# Altium project FlightControl.PrjPcb
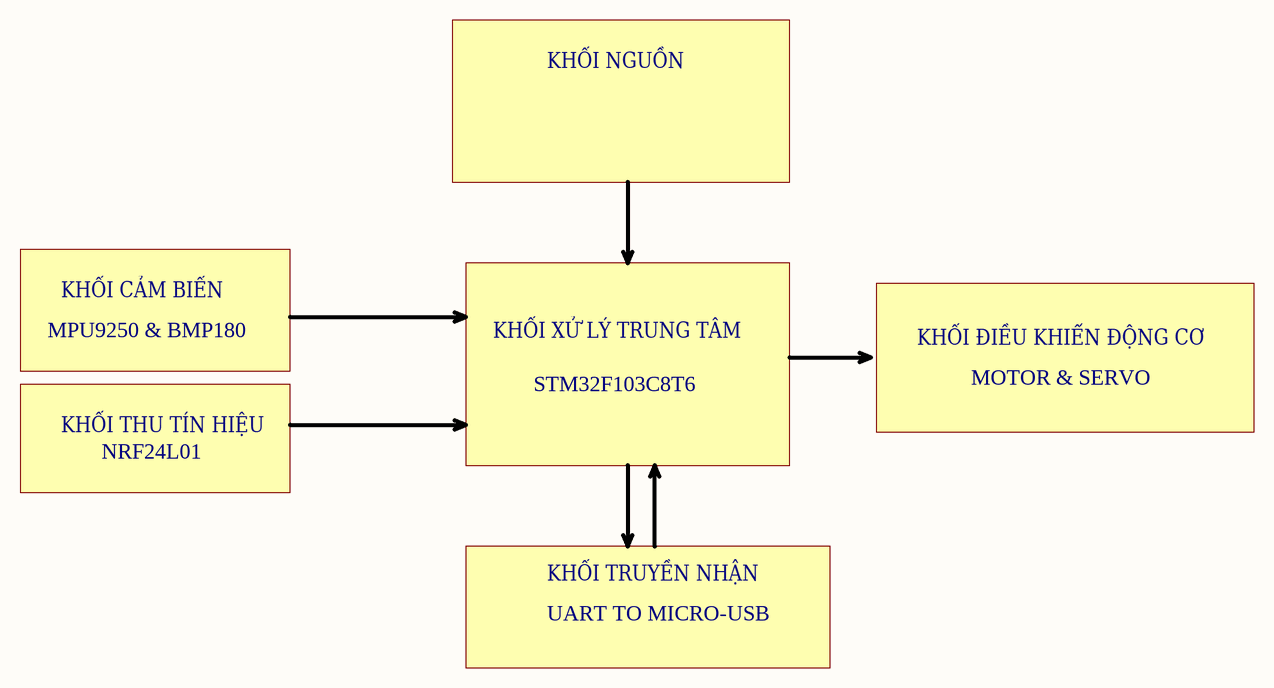
[diagram p0: Block_Diagram.SchDoc]
7 sheets, 90 parts. Net scope: flat (ports and power ports of the same name join across sheets).
Board files: PCB1.PcbDoc, PCB4.PcbDoc
Sheets:
  Block_Diagram.SchDoc
  power_Diagram.SchDoc
  MCU.SchDoc
  Motor_Servo.SchDoc
  Power_Supply.SchDoc
  UART_to_Micro_USB.SchDoc
  Sensor_Input.SchDoc

## Sheet Block_Diagram.SchDoc
size A4; Organization: Altium Limited; Address1: L3, 12a Rodborough Rd; Address2: Frenchs Forest; Address3: NSW; Address4: Australia 2086

### Notes on the sheet
- KHỐI NGUỒN
- KHỐI CẢM BIẾN
- MPU9250 & BMP180
- KHỐI XỬ LÝ TRUNG TÂM
- KHỐI ĐIỀU KHIỂN ĐỘNG CƠ
- MOTOR & SERVO
- KHỐI THU TÍN HIỆU
- STM32F103C8T6
- NRF24L01
- KHỐI TRUYỀN NHẬN
- UART TO MICRO-USB
- Title
- Size:
- Date:
- A4
- Number:
- Time:
- Revision:
- Sheet
- of
- File:

## Sheet power_Diagram.SchDoc
size A4; Organization: Altium Limited; Address1: L3, 12a Rodborough Rd; Address2: Frenchs Forest; Address3: NSW; Address4: Australia 2086
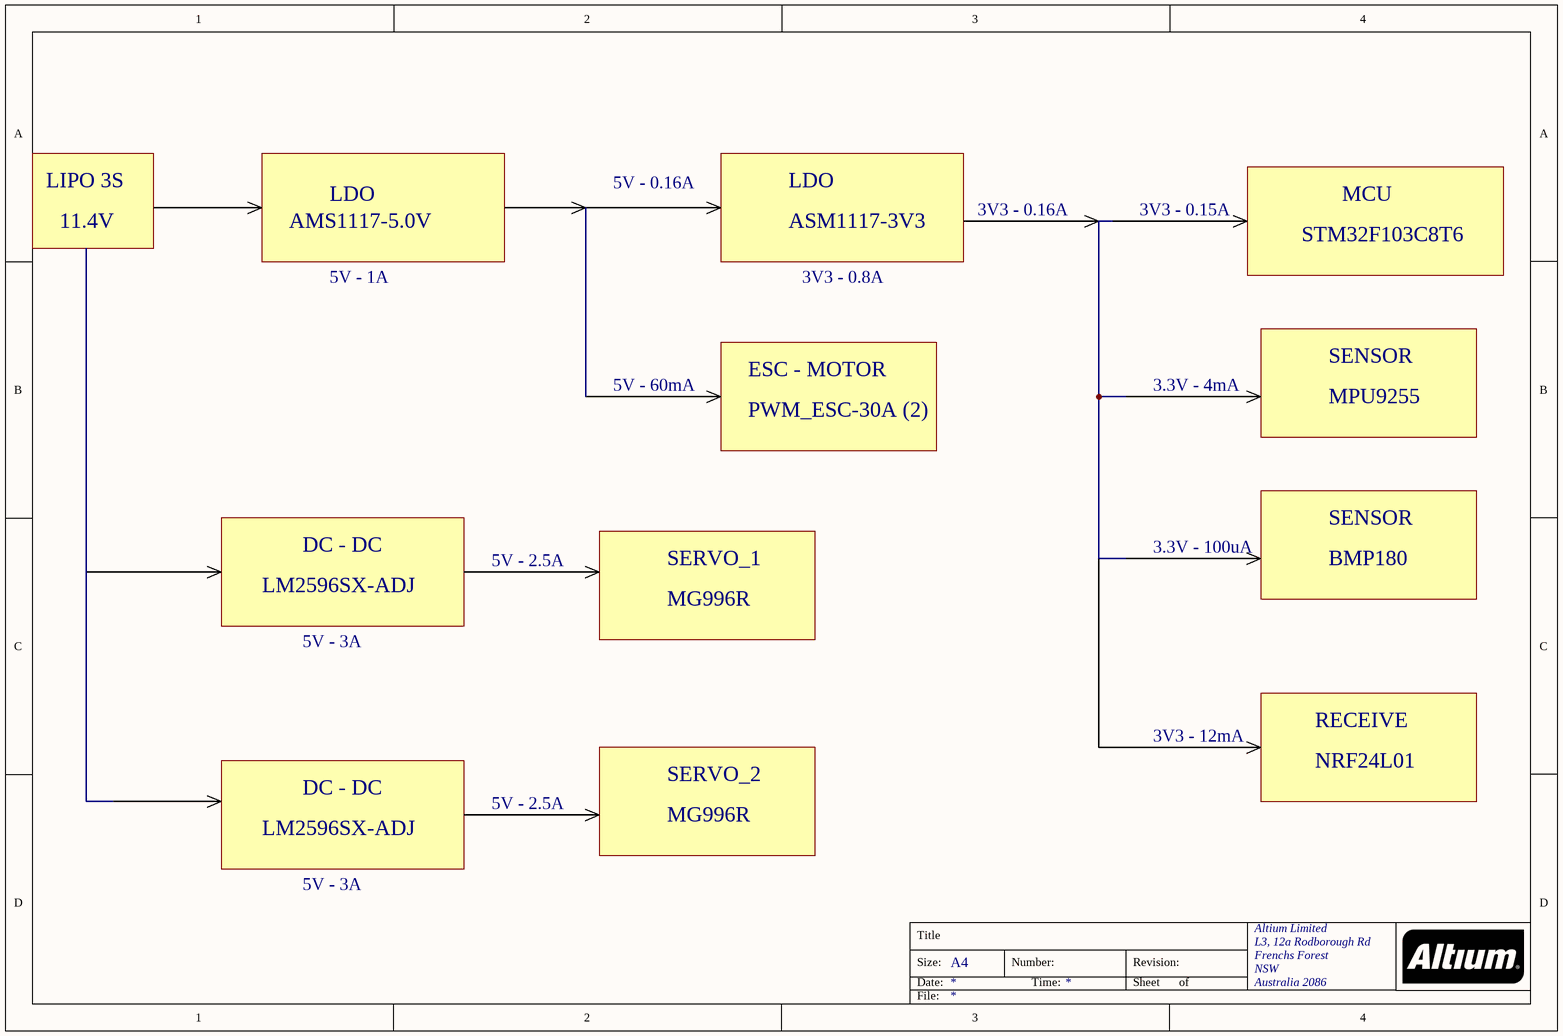
[diagram p1: power_Diagram.SchDoc]

### Notes on the sheet
- LIPO 3S
- 11.4V
- AMS1117-5.0V
- LDO
- 5V - 0.16A
- ASM1117-3V3
- 3V3 - 0.16A
- 3V3 - 0.15A
- STM32F103C8T6
- MCU
- 5V - 1A
- 3V3 - 0.8A
- ESC - MOTOR
- SENSOR
- 5V - 60mA
- PWM_ESC-30A (2)
- 3.3V - 4mA
- MPU9255
- DC - DC
- 5V - 2.5A
- SERVO_1
- 3.3V - 100uA
- BMP180
- LM2596SX-ADJ
- 5V - 3A
- MG996R
- SERVO_2
- 3V3 - 12mA
- RECEIVE
- NRF24L01
- Title
- Size:
- Date:
- A4
- Number:
- Time:
- Revision:
- Sheet
- of
- File:

## Sheet MCU.SchDoc
size A4; Organization: Altium Limited; Address1: L3, 12a Rodborough Rd; Address2: Frenchs Forest; Address3: NSW; Address4: Australia 2086
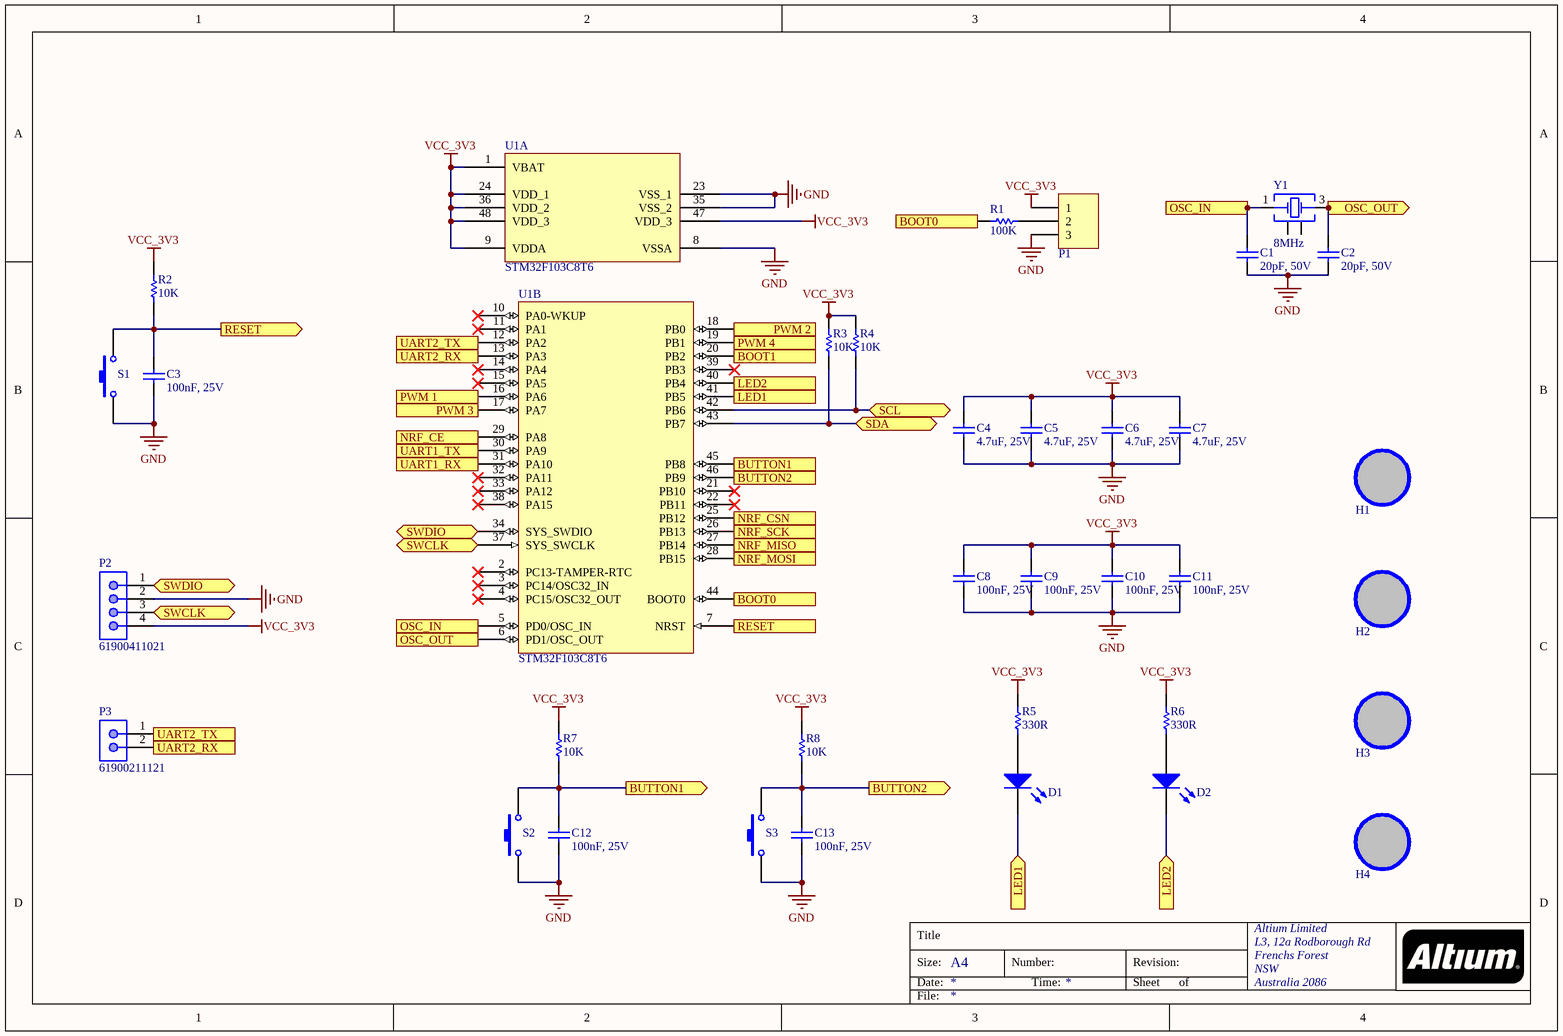
[diagram p2: MCU.SchDoc]

### Parts
C1  value 20pF, 50V  [CAP-SM-0805]  (hidden comment: Cap Non-Pol SMD)
C2  value 20pF, 50V  [CAP-SM-0805]  (hidden comment: Cap Non-Pol SMD)
C3  value 100nF, 25V  [CAP-SM-0805]  (hidden comment: Cap Non-Pol SMD)
C4  value 4.7uF, 25V  [CAP-SM-0805]  (hidden comment: Cap Non-Pol SMD)
C5  value 4.7uF, 25V  [CAP-SM-0805]  (hidden comment: Cap Non-Pol SMD)
C6  value 4.7uF, 25V  [CAP-SM-0805]  (hidden comment: Cap Non-Pol SMD)
C7  value 4.7uF, 25V  [CAP-SM-0805]  (hidden comment: Cap Non-Pol SMD)
C8  value 100nF, 25V  [CAP-SM-0805]  (hidden comment: Cap Non-Pol SMD)
C9  value 100nF, 25V  [CAP-SM-0805]  (hidden comment: Cap Non-Pol SMD)
C10  value 100nF, 25V  [CAP-SM-0805]  (hidden comment: Cap Non-Pol SMD)
C11  value 100nF, 25V  [CAP-SM-0805]  (hidden comment: Cap Non-Pol SMD)
C12  value 100nF, 25V  [CAP-SM-0805]  (hidden comment: Cap Non-Pol SMD)
C13  value 100nF, 25V  [CAP-SM-0805]  (hidden comment: Cap Non-Pol SMD)
D1  LED SMD  [LED_0603_Blue]  (value not drawn)
D2  LED SMD  [LED_0603_Blue]  (value not drawn)
H1  Hole  [LO KHOAN 3MM]  (value not drawn)
H2  Hole  [LO KHOAN 3MM]  (value not drawn)
H3  Hole  [LO KHOAN 3MM]  (value not drawn)
H4  Hole  [LO KHOAN 3MM]  (value not drawn)
P1  Header 3  [JP3]  (value not drawn)
P2  61900411021  [61900411021]
P3  61900211121  [61900211121]
R1  value 100K  [RES-SM-0805]  (hidden comment: RESISTOR SMD)
R2  value 10K  [RES-SM-0805]  (hidden comment: RESISTOR SMD)
R3  value 10K  [RES-SM-0805]  (hidden comment: RESISTOR SMD)
R4  value 10K  [RES-SM-0805]  (hidden comment: RESISTOR SMD)
R5  value 330R  [RES-SM-0805]  (hidden comment: RESISTOR SMD)
R6  value 330R  [RES-SM-0805]  (hidden comment: RESISTOR SMD)
R7  value 10K  [RES-SM-0805]  (hidden comment: RESISTOR SMD)
R8  value 10K  [RES-SM-0805]  (hidden comment: RESISTOR SMD)
S1  Tact SW - 2Pin  [SW-SMD]  (value not drawn)
S2  Tact SW - 2Pin  [SW-SMD]  (value not drawn)
S3  Tact SW - 2Pin  [SW-SMD]  (value not drawn)
U1  STM32F103C8T6  [LQFP48]  (parts A,B of 2)
Y1  8MHz  [WE-XTAL_CFPX-104]

### Ports
BOOT0 (in), BOOT0 (out), BOOT1 (in), BUTTON1 (in), BUTTON1 (out), BUTTON2 (in), BUTTON2 (out), LED1 (in), LED1 (out), LED2 (in), LED2 (out), NRF_CE (out), NRF_CSN (out), NRF_MISO (in), NRF_MOSI (out), NRF_SCK (out), OSC_IN (in), OSC_IN (out), OSC_OUT (in), OSC_OUT (out), PWM 1 (out), PWM 2 (out), PWM 3 (out), PWM 4 (out), RESET (in), RESET (out), SCL (bidir), SDA (bidir), SWCLK (bidir), SWDIO (bidir), UART1_RX (in), UART1_TX (out), UART2_RX (in), UART2_RX (out), UART2_TX (in), UART2_TX (out)

### Nets
GND: C1.1 C2.1 C3.1 C4.1 C5.1 C6.1 C7.1 C8.1 C9.1 C10.1 C11.1 C12.1 C13.1 P1.3 P2.2 S1.1 S2.1 S3.1 U1.8(VSSA) U1.23(VSS_1) U1.35(VSS_2)
VCC_3V3: C4.2 C5.2 C6.2 C7.2 C8.2 C9.2 C10.2 C11.2 P1.1 P2.4 R2.1 R3.1 R4.1 R5.2 R6.2 R7.1 R8.1 U1.1(VBAT) U1.9(VDDA) U1.24(VDD_1) U1.36(VDD_2) U1.47(VDD_3) U1.48(VDD_3)
RXD: U1.31(PA10) ; port UART1_RX
TXD: U1.30(PA9) ; port UART1_TX
Net1_3: R4.2 U1.42(PB6) ; port SCL
Net1_4: R3.2 U1.43(PB7) ; port SDA
NetC1_2: C1.2 U1.5(PD0/OSC_IN) Y1.1(OSC1) ; port OSC_IN
NetC2_2: C2.2 U1.6(PD1/OSC_OUT) Y1.3(OSC2) ; port OSC_OUT
NetC3_2: C3.2 R2.2 S1.2 U1.7(NRST) ; port RESET
NetC12_2: C12.2 R7.2 S2.2 U1.45(PB8) ; port BUTTON1
NetC13_2: C13.2 R8.2 S3.2 U1.46(PB9) ; port BUTTON2
NetD1_1: D1.1(A) R5.1
NetD1_2: D1.2(K) U1.41(PB5) ; port LED1
NetD2_1: D2.1(A) R6.1
NetD2_2: D2.2(K) U1.40(PB4) ; port LED2
NetM1_2: U1.29(PA8) ; port NRF_CE
NetM1_3: U1.26(PB13) ; port NRF_SCK
NetM1_4: U1.27(PB14) ; port NRF_MISO
NetM1_6: U1.28(PB15) ; port NRF_MOSI
NetM1_7: U1.25(PB12) ; port NRF_CSN
NetP1_2: P1.2 R1.2
NetP2_1: P2.1 U1.34(SYS_SWDIO) ; port SWDIO
NetP2_3: P2.3 U1.37(SYS_SWCLK) ; port SWCLK
NetP3_1: P3.1 U1.12(PA2) ; port UART2_TX
NetP3_2: P3.2 U1.13(PA3) ; port UART2_RX
NetP6_3: U1.18(PB0) ; port PWM 2
NetP7_3: U1.19(PB1) ; port PWM 4
NetQ1_2: U1.16(PA6) ; port PWM 1
NetQ2_2: U1.17(PA7) ; port PWM 3
NetR1_1: R1.1 U1.44(BOOT0) ; port BOOT0
NetU1_20: U1.20(PB2) ; port BOOT1

Not connected (* = marked no-connect by the designer): H1 1; H2 1; H3 1; H4 1; U1 2(PC13-TAMPER-RTC)* 3(PC14/OSC32_IN)* 4(PC15/OSC32_OUT)* 10(PA0-WKUP)* 11(PA1)* 14(PA4)* 15(PA5)* 21(PB10)* 22(PB11)* 32(PA11)* 33(PA12)* 38(PA15)* 39(PB3)*; Y1 2(GND) 4(GND)

### Notes on the sheet
- Title
- Size:
- Date:
- A4
- Number:
- Time:
- Revision:
- Sheet
- of
- File:

### Library data of the parts
C1-C13 = Cap Non-Pol SMD: Capacitor
D1 D2 = LED SMD: LED
H1-H4 = Hole: Hole 3mm
P1 = Header 3: Header, 3-Pin; LatestRevisionDate: 17-Jul-2002; LatestRevisionNote: Re-released for DXP Platform.; Publisher: Altium Limited
P2 = 61900411021: WR-WTB THT Male Left Angled Bottom Locking Header, pitch 2.54mm, 4p; Pin Number: 4; Contact Resistance: 20mOhm; Rated Current: 3A; Withstanding Voltage: 1000VAC; Working Voltage: 250VAC; ComponentLink1Description: Manufacturer; ComponentLink1URL: http://www.we-online.de; ComponentLink2Description: Datasheet; ComponentLink2URL: https://www.we-online.com/catalog/datasheet/61900411021.pdf; Pitch: 2.54mm; Published Date: January 2020; Publisher: Wurth Elektronik; Mounting Technology: THT; Packaging: Bag; Operating Temperature: -40 to +105degC; Part Number: 61900411021; Gender: Male; Type: Right Angled Bottom Locking
P3 = 61900211121: WR-WTB THT Male Vertical Locking Header, pitch 2.54mm, 2p; Pin Number: 2; Contact Resistance: 20mOhm; Rated Current: 3A; Withstanding Voltage: 1000VAC; Working Voltage: 250VAC; ComponentLink1Description: Manufacturer; ComponentLink1URL: http://www.we-online.de; ComponentLink2Description: Datasheet; ComponentLink2URL: https://www.we-online.com/catalog/datasheet/61900211121.pdf; Pitch: 2.54mm; Published Date: January 2020; Publisher: Wurth Elektronik; Mounting Technology: THT; Packaging: Bag; Operating Temperature: -40 to +105degC; Part Number: 61900211121; Gender: Male; Type: Vertical
R1-R8 = RESISTOR SMD: Resistor
S1-S3 = Tact SW - 2Pin: Switch button 2 pin
U1 = STM32F103C8T6: ARM Microcontrollers - MCU 32BIT Cortex M3 64KB 20KB RAM 2X12 ADC; Manufacturer: STMicroelectronics; Core: ARM Cortex M3; ADC Resolution: 12 bit; Maximum Clock Frequency: 72 MHz; Number of I/Os: 37 I/O; Supply Voltage - Min: 2 V; Supply Voltage - Max: 3.6 V; Interface Type: CAN, I2C, SPI, USART, USB; Data RAM Type: SRAM; Number of ADC Channels: 10 Channel; Number of Timers/Counters: 3 Timer; Processor Series: ARM Cortex M; Product Category: ARM Microcontrollers - MCU; Series: STM32F103C8; Mounting Style: SMD/SMT; Package / Case: LQFP-48; Program Memory Size: 64 kB; Data Bus Width: 32 bit; Data RAM Size: 20 kB; Minimum Operating Temperature: - 40 C; Maximum Operating Temperature: + 85 C; Length: 7 mm; ComponentLink1Description: Datasheet; ComponentLink1URL: https://www.mouser.vn/datasheet/2/389/stm32f103c8-1851025.pdf
Y1 = 830106162701: WE-XTAL Quartz Crystal, SMT, CFPX-104, 8MHz, +/-20ppm; Manufacturer: Wurth Elektronik; Frequency Stability: +/-30ppm; Load Capacitance: 16pF; ComponentLink1Description: Manufacturer; ComponentLink1URL: http://www.we-online.de; ComponentLink2Description: Datasheet; ComponentLink2URL: https://www.we-online.com/catalog/datasheet/830106162701.pdf; Operating Temperature: -40 to +85degC; Packaging: Tape and Reel; Manufacturer Part Number: 830106162701; Published Date: November 2020; Size: CFPX-104; Frequency: 8MHz; Frequency Tolerance: +/-20ppm; Mounting Technology: SMT

## Sheet Motor_Servo.SchDoc
size A4; Organization: Altium Limited; Address1: L3, 12a Rodborough Rd; Address2: Frenchs Forest; Address3: NSW; Address4: Australia 2086
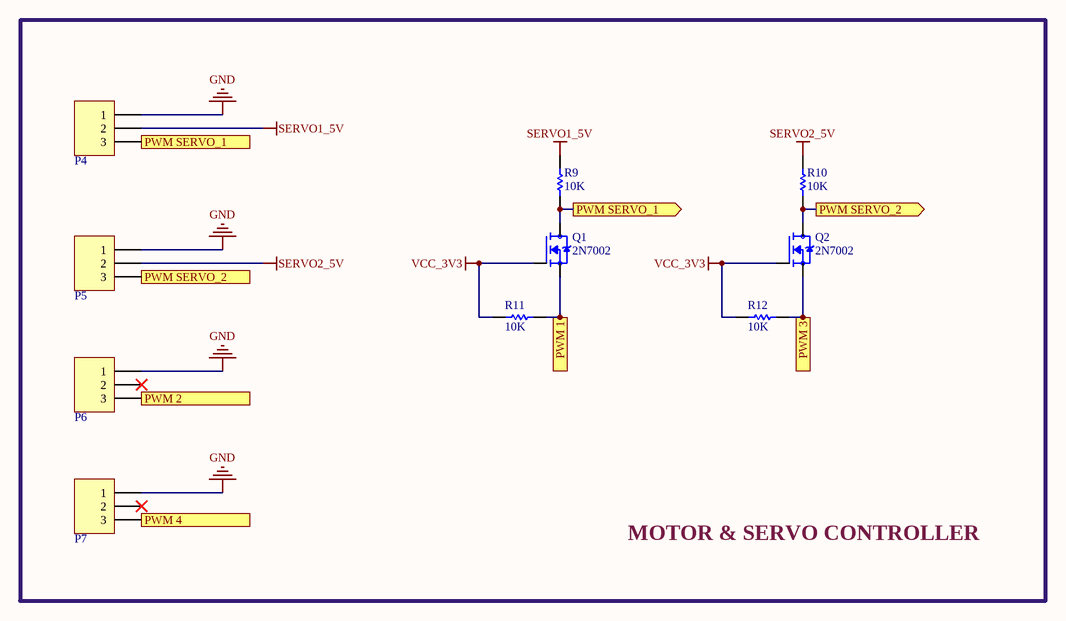
[diagram p3: Motor_Servo.SchDoc]

### Parts
P4  Header 3H  [JP3H]  (value not drawn)
P5  Header 3H  [JP3H]  (value not drawn)
P6  Header 3H  [JP3H]  (value not drawn)
P7  Header 3H  [JP3H]  (value not drawn)
Q1  2N7002  [SOT95P240X111-3N]
Q2  2N7002  [SOT95P240X111-3N]
R9  value 10K  [RES-SM-0805]  (hidden comment: RESISTOR SMD)
R10  value 10K  [RES-SM-0805]  (hidden comment: RESISTOR SMD)
R11  value 10K  [RES-SM-0805]  (hidden comment: RESISTOR SMD)
R12  value 10K  [RES-SM-0805]  (hidden comment: RESISTOR SMD)

### Blocks framed on the sheet
MOTOR & SERVO CONTROLLER: P4-P7 Q1 Q2 R9-R12

### Ports
PWM 1 (in), PWM 2 (out), PWM 3 (in), PWM 4 (out), PWM SERVO_1 (out), PWM SERVO_2 (out)

### Nets
GND: P4.1 P5.1 P6.1 P7.1
SERVO1_5V: P4.2 R9.2
SERVO2_5V: P5.2 R10.2
VCC_3V3: Q1.1(G) Q2.1(G) R11.2 R12.2
NetP4_3: P4.3 Q1.3(D) R9.1 ; port PWM SERVO_1
NetP5_3: P5.3 Q2.3(D) R10.1 ; port PWM SERVO_2
NetP6_3: P6.3 ; port PWM 2
NetP7_3: P7.3 ; port PWM 4
NetQ1_2: Q1.2(S) R11.1 ; port PWM 1
NetQ2_2: Q2.2(S) R12.1 ; port PWM 3

Not connected (* = marked no-connect by the designer): P6 2*; P7 2*

### Notes on the sheet
- Title
- Size:
- Date:
- A4
- Number:
- Time:
- Revision:
- Sheet
- of
- File:

### Library data of the parts
P4-P7 = Header 3H: Header, 3-Pin, Right Angle; LatestRevisionDate: 17-Jul-2002; LatestRevisionNote: Re-released for DXP Platform.; Publisher: Altium Limited
Q1 Q2 = 2N7002: N-Channel 60V 280mA (Ta) 350mW (Ta) Surface Mount SOT-23-3 (TO-236); MP: altium_native_batch; Package: None; Price: None; Availability: Unavailable; Value: *
R9-R12 = RESISTOR SMD: Resistor

## Sheet Power_Supply.SchDoc
size A4; Organization: Altium Limited; Address1: L3, 12a Rodborough Rd; Address2: Frenchs Forest; Address3: NSW; Address4: Australia 2086
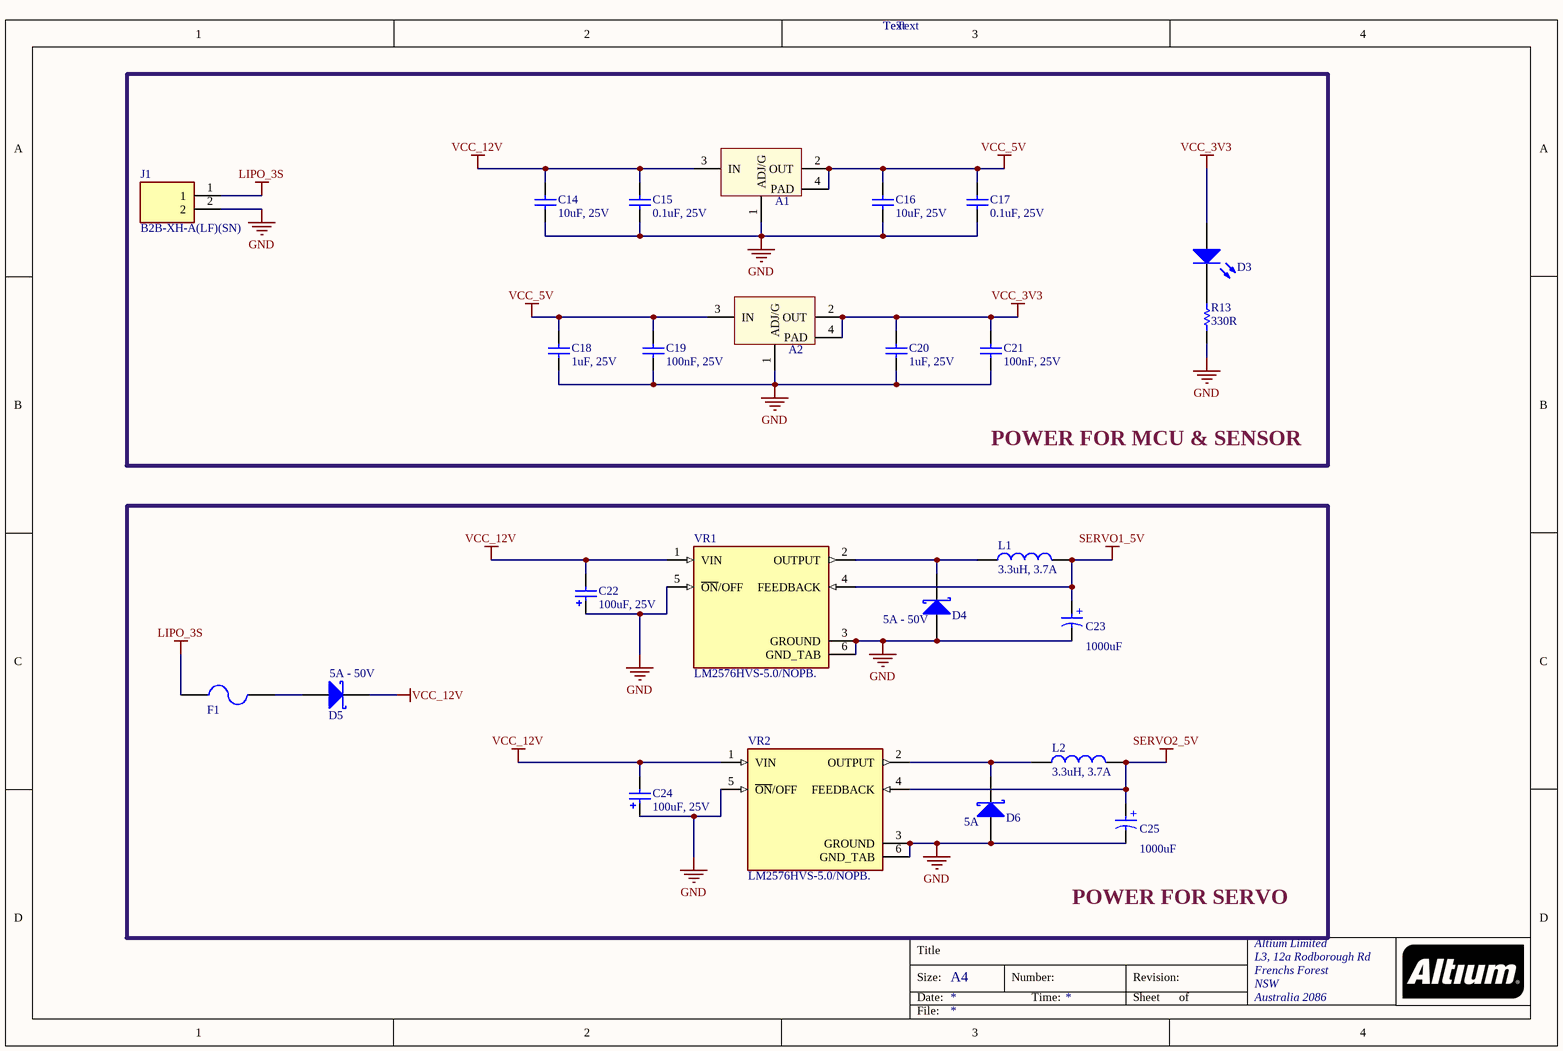
[diagram p4: Power_Supply.SchDoc]

### Parts
A1  LM1117  [SOT223-4N]  (value not drawn)
A2  LM1117  [SOT223-4N]  (value not drawn)
C14  value 10uF, 25V  [CAP-SM-0805]  (hidden comment: Cap Non-Pol SMD)
C15  value 0.1uF, 25V  [CAP-SM-0805]  (hidden comment: Cap Non-Pol SMD)
C16  value 10uF, 25V  [CAP-SM-0805]  (hidden comment: Cap Non-Pol SMD)
C17  value 0.1uF, 25V  [CAP-SM-0805]  (hidden comment: Cap Non-Pol SMD)
C18  value 1uF, 25V  [CAP-SM-0805]  (hidden comment: Cap Non-Pol SMD)
C19  value 100nF, 25V  [CAP-SM-0805]  (hidden comment: Cap Non-Pol SMD)
C20  value 1uF, 25V  [CAP-SM-0805]  (hidden comment: Cap Non-Pol SMD)
C21  value 100nF, 25V  [CAP-SM-0805]  (hidden comment: Cap Non-Pol SMD)
C22  value 100uF, 25V  [CAP ALU SIZE F]  (hidden comment: Cap Pol SMD)
C23  1000uF  [WCAP-ASLI_D12.5H14]  (value not drawn)
C24  value 100uF, 25V  [CAP ALU SIZE F]  (hidden comment: Cap Pol SMD)
C25  1000uF  [WCAP-ASLI_D12.5H14]  (value not drawn)
D3  LED SMD  [LED_0603_Blue]  (value not drawn)
D4  D Schottky  [SS34]  (value not drawn)
D5  D Schottky  [SS34]  (value not drawn)
D6  D Schottky  [SS34]  (value not drawn)
F1  Fuse  [FUSE SMD]  (value not drawn)
J1  B2B-XH-A(LF)(SN)  [JST_B2B-XH-A(LF)(SN)]
L1  3.3uH, 3.7A  [WE-PD2A_5848]
L2  3.3uH, 3.7A  [WE-PD2A_5848]
R13  value 330R  [RES-SM-0805]  (hidden comment: RESISTOR SMD)
VR1  LM2576HVS-5.0/NOPB.  [TO170P1524X483-6N]
VR2  LM2576HVS-5.0/NOPB.  [TO170P1524X483-6N]

### Blocks framed on the sheet
POWER FOR MCU & SENSOR: A1 A2 C14-C21 D3 J1 R13
POWER FOR SERVO: C22-C25 D4-D6 F1 L1 L2 VR1 VR2

### Nets
GND: A1.1(ADJ/G) A2.1(ADJ/G) C14.1 C15.1 C16.1 C17.1 C18.1 C19.1 C20.1 C21.1 C22.1 C23.2(N) C24.1 C25.2(N) D4.1(A) D6.1(A) J1.2 R13.2 VR1.3(GROUND) VR1.5(~{ON}/OFF) VR1.6(GND_TAB) VR2.3(GROUND) VR2.5(~{ON}/OFF) VR2.6(GND_TAB)
LIPO_3S: F1.1 J1.1
SERVO1_5V: C23.1(P) L1.2 VR1.4(FEEDBACK)
SERVO2_5V: C25.1(P) L2.2 VR2.4(FEEDBACK)
VCC_3V3: A2.2(OUT) A2.4(PAD) C20.2 C21.2 D3.1(A)
VCC_5V: A1.2(OUT) A1.4(PAD) A2.3(IN) C16.2 C17.2 C18.2 C19.2
VCC_12V: A1.3(IN) C14.2 C15.2 C22.2 C24.2 D5.2(K) VR1.1(VIN) VR2.1(VIN)
NetD3_2: D3.2(K) R13.1
NetD4_2: D4.2(K) L1.1 VR1.2(OUTPUT)
NetD5_1: D5.1(A) F1.2
NetD6_2: D6.2(K) L2.1 VR2.2(OUTPUT)

### Notes on the sheet
- Text
- (near D4) 5A - 50V
- (near C23) 1000uF
- (near D5) 5A - 50V
- (near D6) 5A
- (near C25) 1000uF
- Title
- Size:
- Date:
- A4
- Number:
- Time:
- Revision:
- Sheet
- of
- File:
- (in symbol 865080462016) +

### Library data of the parts
A1 A2 = LM1117: Available in 1.8V, 2.5V, 2.85V, 3.3V, 5V, and  Adjustable Versions; Value: LM317
C14-C21 = Cap Non-Pol SMD: Capacitor
C22 C24 = Cap Pol SMD: Polarized Capacitor (Radial)
C23 C25 = 865080462016: WCAP-ASLI Aluminum Electrolytic Capacitor, V-Chip, D12.5 x H14mm, 1000uF, 25V; Manufacturer: Wurth Elektronik; Capacitance Tolerance: +/-20%; Dissipation Factor: 14%; Endurance: 5000h; Leakage Current: 250uA; Ripple Current: 1100mA; Technical Reference: ASEH140102M025DVCTGE000; Manufacturer Part Number: 865080462016; Category: Aluminum Electrolytic Capacitors; Match Code: WCAP-ASLI; ComponentLink1Description: Website Link; ComponentLink1URL: https://www.we-online.com/redexpert/article/865080462016?ad; ComponentLink2Description: Datasheet Link; ComponentLink2URL: https://www.we-online.com/redexpert/spec/865080462016?ad; Mount: Surface Mount; Operating Temperature Max: 105°C; Operating Temperature Min: -55°C; Packaging: Tape and Reel; Height: 14mm; Diameter: 12.5mm; Capacitance: 1000uF; Rated Voltage (DC): 25V
D3 = LED SMD: LED
D4-D6 = D Schottky: Schottky Diode; Published: 8-Jun-2000; LatestRevisionDate: 17-Jul-2002; LatestRevisionNote: Re-released for DXP Platform.; PackageReference: SMB; Publisher: Altium Limited; PackageDescription: DO-214-AA/SMB; 2 C-Bend Leads; Body 5.3 x 3.6 mm, inc. leads (LxW); Code_JEDEC: DO-214-AA
J1 = B2B-XH-A(LF)(SN): Connector Header Through Hole 2 position 0.098 (2.50mm); MF: JST Sales; Value: *; MP: B2B-XH-A(LF)(SN); Purchase-URL: https://pricing.snapeda.com/search/part/B2B-XH-A(LF)(SN)/?ref=eda; Availability: In Stock; Price: None; Package: None
L1 L2 = 784774033: WE-PD2A SMT Power Inductor, size 5848, 3.3uH, 3.7A; Manufacturer: Wurth Elektronik; DC Resistance max.: 0.06Ohm; Saturation Current: 7.5A; Self Resonant Frequency: 43MHz; DC Resistance typ.: 0.042Ohm; Rated Voltage: 80VDC; ComponentLink1Description: Manufacturer; ComponentLink1URL: http://www.we-online.de; ComponentLink2Description: Datasheet; ComponentLink2URL: https://www.we-online.com/catalog/datasheet/784774033.pdf; Manufacturer Part Number: 784774033; Published Date: May 2020; Rated Current: 3.7A; Inductance: 3.3uH; Operating Temperature: -40 to +125degC; Mounting Technology: SMT; Packaging: Tape and Reel; Size: 5848
R13 = RESISTOR SMD: Resistor
VR1 VR2 = LM2596S-5.0: SIMPLE SWITCHER&reg; 4.5V to 40V, 3A Low Component Count Step-Down Regulator; MP: LM2596S-5.0/NOPB; MF: Texas Instruments; Price: None; Availability: In Stock; Package: TO-263-5 Texas Instruments; SnapEDA_Link: https://www.snapeda.com/parts/LM2596S-5.0/NOPB/Texas+Instruments/view-part/?ref=snap; Check_prices: https://www.snapeda.com/parts/LM2596S-5.0/NOPB/Texas+Instruments/view-part/?ref=eda; Value: *; Purchase-URL: https://pricing.snapeda.com/search/part/LM2596S-5.0/NOPB/?ref=eda

## Sheet UART_to_Micro_USB.SchDoc
size A4; Organization: Altium Limited; Address1: L3, 12a Rodborough Rd; Address2: Frenchs Forest; Address3: NSW; Address4: Australia 2086
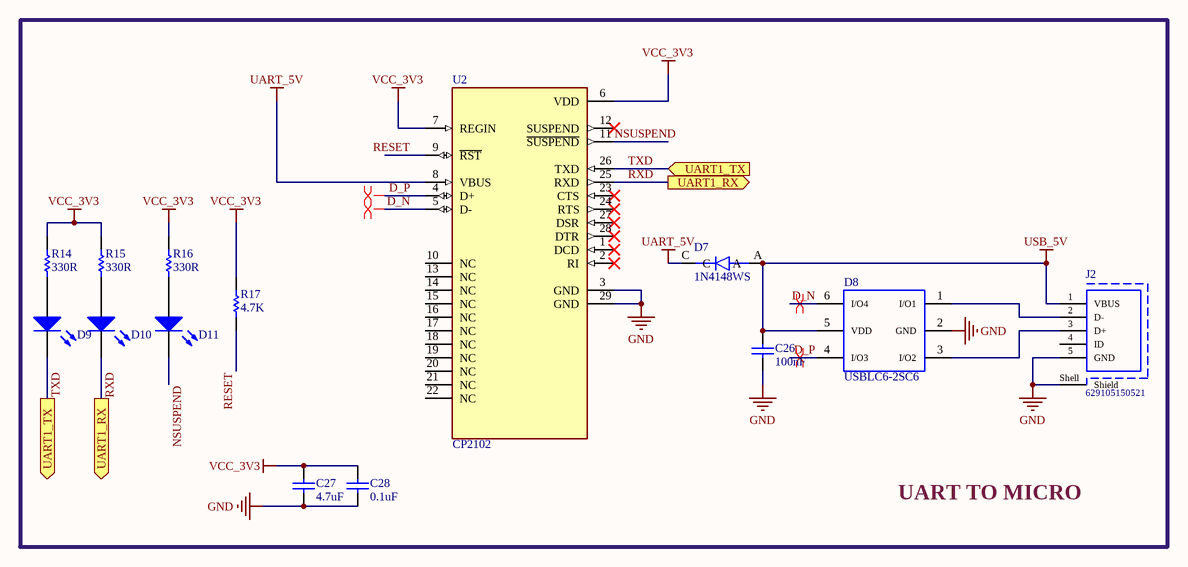
[diagram p5: UART_to_Micro_USB.SchDoc]

### Parts
C26  value 100nF  [CAP-SM-0805]  (hidden comment: Cap Non-Pol SMD)
C27  value 4.7uF  [CAP-SM-0805]  (hidden comment: Cap Non-Pol SMD)
C28  value 0.1uF  [CAP-SM-0805]  (hidden comment: Cap Non-Pol SMD)
D7  1N4148WS  [SODFL2512X100N]
D8  USBLC6-2SC6  [WE-TVS_SOT23-6L]
D9  LED SMD  [LED_0603_Blue]  (value not drawn)
D10  LED SMD  [LED_0603_Blue]  (value not drawn)
D11  LED SMD  [LED_0603_Blue]  (value not drawn)
J2  629105150521  [629105150521]
R14  value 330R  [RES-SM-0805]  (hidden comment: RESISTOR SMD)
R15  value 330R  [RES-SM-0805]  (hidden comment: RESISTOR SMD)
R16  value 330R  [RES-SM-0805]  (hidden comment: RESISTOR SMD)
R17  value 4.7K  [RES-SM-0805]  (hidden comment: RESISTOR SMD)
U2  CP2102  [QFN50P500X500X100-29N]

### Blocks framed on the sheet
UART TO MICRO: C26-C28 D7-D11 J2 R14-R17 U2

### Ports
UART1_RX (out), UART1_TX (in), UART1_TX (out)

### Nets
GND: C26.1 C27.1 C28.1 D8.2(GND) J2.5(GND) J2.Shell(Shield) U2.3(GND) U2.29(GND)
UART_5V: D7.C U2.8(VBUS)
USB_5V: C26.2 D7.A D8.5(VDD) J2.1(VBUS)
VCC_3V3: C27.2 C28.2 R14.2 R15.2 R16.2 R17.1 U2.6(VDD) U2.7(REGIN)
D_N: D8.6(I/O4) U2.5(D-)
D_P: D8.4(I/O3) U2.4(D+)
NSUSPEND: D11.2(K) U2.11(~{SUSPEND})
RESET: R17.2 U2.9(~{RST})
RXD: D10.2(K) U2.25(RXD) ; port UART1_RX
TXD: D9.2(K) U2.26(TXD) ; port UART1_TX
NetD8_1: D8.1(I/O1) J2.2(D-)
NetD8_3: D8.3(I/O2) J2.3(D+)
NetD9_1: D9.1(A) R14.1
NetD10_1: D10.1(A) R15.1
NetD11_1: D11.1(A) R16.1

Not connected (* = marked no-connect by the designer): J2 4(ID); U2 1(DCD)* 2(RI)* 10(NC) 12(SUSPEND)* 13(NC) 14(NC) 15(NC) 16(NC) 17(NC) 18(NC) 19(NC) 20(NC) 21(NC) 22(NC) 23(CTS)* 24(RTS)* 27(DSR)* 28(DTR)*

### Layout directives
differential pair: D_N, D_P

### Notes on the sheet
- Title
- Size:
- Date:
- A4
- Number:
- Time:
- Revision:
- Sheet
- of
- File:

### Library data of the parts
C26-C28 = Cap Non-Pol SMD: Capacitor
D7 = 1N4148WS: Diode Standard 75V 300mA (DC) Surface Mount SOD-323; MF: ON Semiconductor; Purchase-URL: https://pricing.snapeda.com/search/part/1N4148WS/?ref=eda; Value: *; Package: SOD-323FL-2 ON Semiconductor; Availability: In Stock; Price: None; MP: 1N4148WS
D8 = 824001: WE-TVS TVS Diode - High Speed Series, SOT23-6L, 4+1Channel, 5Vdc; Manufacturer: Wurth Elektronik; Reverse Breakdown Voltage min.: 6.2V; Channel: 4+1; Channel Input Capacitance: 1pF; Reverse Peak Pulse Current: 5A; Reverse Channel Leakage Current: 5uA; DC Operating Voltage: 5V; ComponentLink1Description: Manufacturer; ComponentLink1URL: http://www.we-online.de; ComponentLink2Description: Datasheet; ComponentLink2URL: https://www.we-online.com/catalog/datasheet/824001.pdf; Manufacturer Part Number: 824001; Published Date: April 2020; Size: SOT23-6L; Operating Temperature: -40 to +125degC; Mounting Technology: SMT; Packaging: Tape and Reel
D9-D11 = LED SMD: LED
J2 = 629105150521: Micro USB 2.0 Type B Receptacle WR-COM, Horizontal, SMT, with Pegs, High Current at Pin 1 & Pin 5; Rated Current: 3 A; Contact Resistance: 30 mOhm; Working Voltage: 30 VAC; ComponentLink1Description: Manufacturer; ComponentLink1URL: http://www.we-online.de; ComponentLink2Description: Datasheet; ComponentLink2URL: https://katalog.we-online.de/em/datasheet/629105150521.pdf; Part Number: 629105150521; Published Date: September 2018; Publisher: Wurth Elektronik; Orientation: Horizontal; Connector Type: Micro USB 2.0 Type B; Operating Temperature: -40 to 85 degC; Mounting Technology: SMT; Gender: Receptacle; Packaging: Tape and Reel
R14-R17 = RESISTOR SMD: Resistor
U2 = CP2102: CP2102N USB 2.0 to UART (RS232) Bridge Interface Evaluation Board; MF: Silicon Labs; Purchase-URL: https://pricing.snapeda.com/search/part/CP2102/?ref=eda; Package: WFQFN-20 Silicon Labs; Value: *; Check_prices: https://www.snapeda.com/parts/CP2102/Silicon+Labs/view-part/?ref=eda; SnapEDA_Link: https://www.snapeda.com/parts/CP2102/Silicon+Labs/view-part/?ref=snap; Availability: In Stock; Price: None; MP: CP2102

## Sheet Sensor_Input.SchDoc
size A4; Organization: Altium Limited; Address1: L3, 12a Rodborough Rd; Address2: Frenchs Forest; Address3: NSW; Address4: Australia 2086
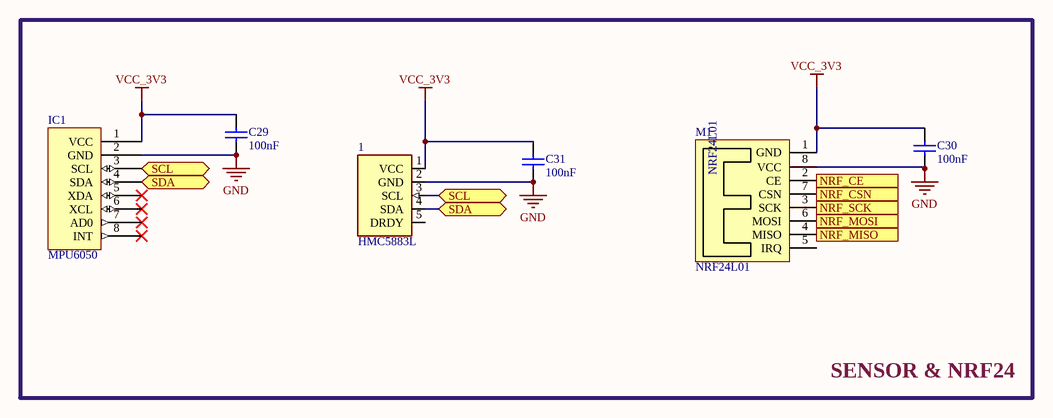
[diagram p6: Sensor_Input.SchDoc]

### Parts
1  HMC5883L  [HMC5883L]
C29  value 100nF  [CAP-SM-0805]  (hidden comment: Cap Non-Pol SMD)
C30  value 100nF  [CAP-SM-0805]  (hidden comment: Cap Non-Pol SMD)
C31  value 100nF  [CAP-SM-0805]  (hidden comment: Cap Non-Pol SMD)
IC1  MPU6050  [MPU6050_H]
M1  NRF24L01  [NRF24L01]

### Blocks framed on the sheet
SENSOR & NRF24: 1 C29-C31 IC1 M1

### Ports
NRF_CE (in), NRF_CSN (in), NRF_MISO (out), NRF_MOSI (in), NRF_SCK (in), SCL (bidir), SDA (bidir)

### Nets
GND: 1.2(GND) C29.1 C30.1 C31.1 IC1.2(GND) M1.8(VCC)
VCC_3V3: 1.1(VCC) C29.2 C30.2 C31.2 IC1.1(VCC) M1.1(GND)
Net1_3: 1.3(SCL) IC1.3(SCL) ; port SCL
Net1_4: 1.4(SDA) IC1.4(SDA) ; port SDA
NetM1_2: M1.2(CE) ; port NRF_CE
NetM1_3: M1.3(SCK) ; port NRF_SCK
NetM1_4: M1.4(MISO) ; port NRF_MISO
NetM1_6: M1.6(MOSI) ; port NRF_MOSI
NetM1_7: M1.7(CSN) ; port NRF_CSN

Not connected (* = marked no-connect by the designer): 1 5(DRDY); IC1 5(XDA)* 6(XCL)* 7(AD0)* 8(INT)*; M1 5(IRQ)

### Notes on the sheet
- Title
- Size:
- Date:
- A4
- Number:
- Time:
- Revision:
- Sheet
- of
- File:

### Library data of the parts
1 = HMC5883L: HMC5883L HMC Magnetic, Digital Compass Sensor Evaluation Board; MF: Honeywell Aerospace; Availability: Unavailable; SnapEDA_Link: https://www.snapeda.com/parts/HMC5883L/Honeywell%20Aerospace/view-part/106081/?ref=snap; MP: HMC5883L; Price: None; Package: LCC-16 Honeywell; Value: *
C29-C31 = Cap Non-Pol SMD: Capacitor
IC1 = IMU MPU6050: GY-521 6DOF IMU MPU6050 / TECHMT.VN; WEB: TECHMT.VN

## Nets that join several sheets
GND: MCU (21 pins), Motor_Servo (P4.1 P5.1 P6.1 P7.1), Power_Supply (24 pins), UART_to_Micro_USB (8 pins), Sensor_Input (6 pins)
SERVO1_5V: Motor_Servo (P4.2 R9.2), Power_Supply (C23.1 L1.2 VR1.4)
SERVO2_5V: Motor_Servo (P5.2 R10.2), Power_Supply (C25.1 L2.2 VR2.4)
VCC_3V3: MCU (23 pins), Motor_Servo (Q1.1 Q2.1 R11.2 R12.2), Power_Supply (5 pins), UART_to_Micro_USB (8 pins), Sensor_Input (6 pins)
Net1_3: MCU (R4.2 U1.42), Sensor_Input (1.3 IC1.3)
Net1_4: MCU (R3.2 U1.43), Sensor_Input (1.4 IC1.4)
NetM1_2: MCU (U1.29), Sensor_Input (M1.2)
NetM1_3: MCU (U1.26), Sensor_Input (M1.3)
NetM1_4: MCU (U1.27), Sensor_Input (M1.4)
NetM1_6: MCU (U1.28), Sensor_Input (M1.6)
NetM1_7: MCU (U1.25), Sensor_Input (M1.7)
NetP6_3: MCU (U1.18), Motor_Servo (P6.3)
NetP7_3: MCU (U1.19), Motor_Servo (P7.3)
NetQ1_2: MCU (U1.16), Motor_Servo (Q1.2 R11.1)
NetQ2_2: MCU (U1.17), Motor_Servo (Q2.2 R12.1)
RXD: MCU (U1.31), UART_to_Micro_USB (D10.2 U2.25)
TXD: MCU (U1.30), UART_to_Micro_USB (D9.2 U2.26)